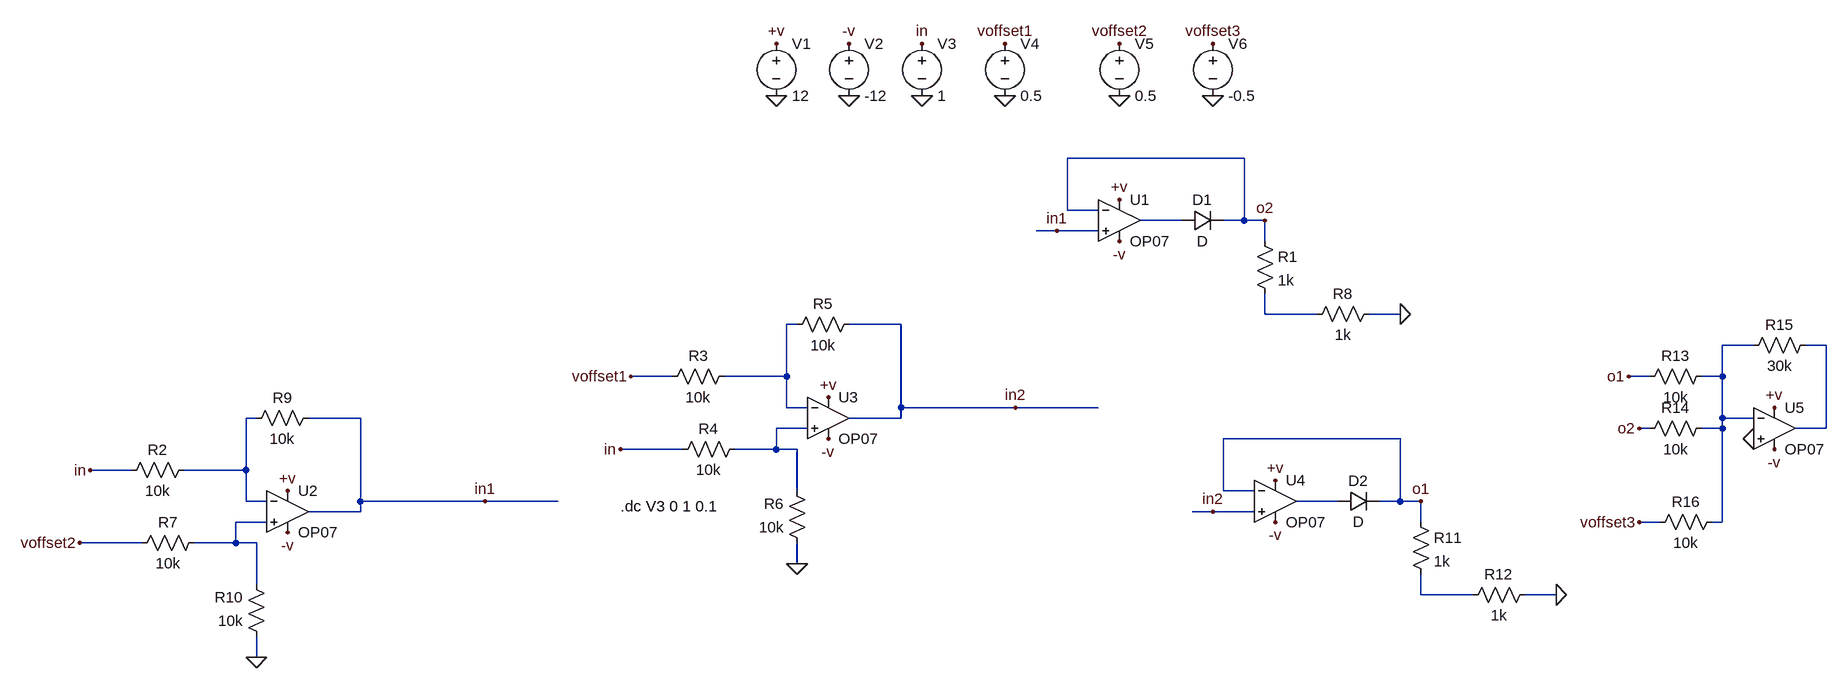
[diagram p0: schematic tent-map.asc]
tent-map.asc, the LTspice schematic file:
Version 4
SHEET 1 1508 996
WIRE 608 208 336 208
WIRE 336 288 336 208
WIRE 384 288 336 288
WIRE 512 304 448 304
WIRE 608 304 608 208
WIRE 608 304 576 304
WIRE 640 304 608 304
WIRE 320 320 288 320
WIRE 384 320 320 320
WIRE 640 336 640 304
WIRE 640 448 640 416
WIRE 720 448 640 448
WIRE 848 448 800 448
WIRE -80 464 -96 464
WIRE 80 464 0 464
WIRE 1392 496 1344 496
WIRE 1504 496 1472 496
WIRE -272 544 -336 544
WIRE -96 544 -96 464
WIRE -96 544 -192 544
WIRE 1232 544 1200 544
WIRE 1344 544 1344 496
WIRE 1344 544 1312 544
WIRE -96 592 -96 544
WIRE -64 592 -96 592
WIRE 80 592 80 464
WIRE 256 592 80 592
WIRE 384 592 256 592
WIRE -912 608 -928 608
WIRE -752 608 -832 608
WIRE 80 608 80 592
WIRE 80 608 0 608
WIRE 1344 608 1344 544
WIRE 1392 608 1344 608
WIRE -64 624 -112 624
WIRE 1232 624 1216 624
WIRE 1344 624 1344 608
WIRE 1344 624 1312 624
WIRE 1504 624 1504 496
WIRE 1504 624 1456 624
WIRE 848 640 576 640
WIRE -256 656 -352 656
WIRE -112 656 -112 624
WIRE -112 656 -176 656
WIRE -80 656 -112 656
WIRE -1104 688 -1168 688
WIRE -928 688 -928 608
WIRE -928 688 -1024 688
WIRE -80 720 -80 656
WIRE 576 720 576 640
WIRE 624 720 576 720
WIRE -928 736 -928 688
WIRE -896 736 -928 736
WIRE -752 736 -752 608
WIRE -560 736 -752 736
WIRE -448 736 -560 736
WIRE 752 736 688 736
WIRE 848 736 848 640
WIRE 848 736 816 736
WIRE 880 736 848 736
WIRE -752 752 -752 736
WIRE -752 752 -832 752
WIRE 560 752 528 752
WIRE 624 752 560 752
WIRE -896 768 -944 768
WIRE 880 768 880 736
WIRE 1248 768 1216 768
WIRE 1344 768 1344 624
WIRE 1344 768 1328 768
WIRE -1088 800 -1184 800
WIRE -944 800 -944 768
WIRE -944 800 -1008 800
WIRE -912 800 -944 800
WIRE -80 832 -80 800
WIRE -912 864 -912 800
WIRE 880 880 880 848
WIRE 960 880 880 880
WIRE 1088 880 1040 880
WIRE -912 976 -912 944
FLAG -112 112 0
FLAG 0 112 0
FLAG 112 112 0
FLAG -112 32 +v
FLAG 0 32 -v
FLAG 112 32 in
FLAG 416 272 +v
FLAG 416 336 -v
FLAG -32 576 +v
FLAG -32 640 -v
FLAG 240 112 0
FLAG 240 32 voffset1
FLAG -80 832 0
FLAG 848 448 0
FLAG -352 656 in
FLAG -336 544 voffset1
FLAG -864 720 +v
FLAG -864 784 -v
FLAG -912 976 0
FLAG 416 112 0
FLAG 416 32 voffset2
FLAG -1168 688 in
FLAG -1184 800 voffset2
FLAG 656 704 +v
FLAG 656 768 -v
FLAG 1088 880 0
FLAG -560 736 in1
FLAG 320 320 in1
FLAG 256 592 in2
FLAG 560 752 in2
FLAG 880 736 o1
FLAG 1200 544 o1
FLAG 640 304 o2
FLAG 1216 624 o2
FLAG 1392 640 0
FLAG 1424 592 +v
FLAG 1424 656 -v
FLAG 1216 768 voffset3
FLAG 560 112 0
FLAG 560 32 voffset3
SYMBOL voltage -112 16 R0
WINDOW 123 0 0 Left 0
WINDOW 39 0 0 Left 0
SYMATTR InstName V1
SYMATTR Value 12
SYMBOL voltage 0 16 R0
WINDOW 123 0 0 Left 0
WINDOW 39 0 0 Left 0
SYMATTR InstName V2
SYMATTR Value -12
SYMBOL voltage 112 16 R0
WINDOW 123 0 0 Left 0
WINDOW 39 0 0 Left 0
SYMATTR InstName V3
SYMATTR Value 1
SYMBOL OpAmps\\OP07 416 240 R0
SYMATTR InstName U1
SYMBOL diode 512 320 R270
WINDOW 0 32 32 VTop 2
WINDOW 3 0 32 VBottom 2
SYMATTR InstName D1
SYMBOL res 624 320 R0
SYMATTR InstName R1
SYMATTR Value 1k
SYMBOL OpAmps\\OP07 -32 544 R0
SYMATTR InstName U3
SYMBOL voltage 240 16 R0
WINDOW 123 0 0 Left 0
WINDOW 39 0 0 Left 0
SYMATTR InstName V4
SYMATTR Value 0.5
SYMBOL res -176 528 R90
WINDOW 0 0 56 VBottom 2
WINDOW 3 32 56 VTop 2
SYMATTR InstName R3
SYMATTR Value 10k
SYMBOL res -160 640 R90
WINDOW 0 0 56 VBottom 2
WINDOW 3 32 56 VTop 2
SYMATTR InstName R4
SYMATTR Value 10k
SYMBOL res 16 448 R90
WINDOW 0 0 56 VBottom 2
WINDOW 3 32 56 VTop 2
SYMATTR InstName R5
SYMATTR Value 10k
SYMBOL res -64 816 R180
WINDOW 0 36 76 Left 2
WINDOW 3 36 40 Left 2
SYMATTR InstName R6
SYMATTR Value 10k
SYMBOL res 816 432 R90
WINDOW 0 0 56 VBottom 2
WINDOW 3 32 56 VTop 2
SYMATTR InstName R8
SYMATTR Value 1k
SYMBOL OpAmps\\OP07 -864 688 R0
SYMATTR InstName U2
SYMBOL res -1008 672 R90
WINDOW 0 0 56 VBottom 2
WINDOW 3 32 56 VTop 2
SYMATTR InstName R2
SYMATTR Value 10k
SYMBOL res -992 784 R90
WINDOW 0 0 56 VBottom 2
WINDOW 3 32 56 VTop 2
SYMATTR InstName R7
SYMATTR Value 10k
SYMBOL res -816 592 R90
WINDOW 0 0 56 VBottom 2
WINDOW 3 32 56 VTop 2
SYMATTR InstName R9
SYMATTR Value 10k
SYMBOL res -896 960 R180
WINDOW 0 36 76 Left 2
WINDOW 3 36 40 Left 2
SYMATTR InstName R10
SYMATTR Value 10k
SYMBOL voltage 416 16 R0
WINDOW 123 0 0 Left 0
WINDOW 39 0 0 Left 0
SYMATTR InstName V5
SYMATTR Value 0.5
SYMBOL OpAmps\\OP07 656 672 R0
SYMATTR InstName U4
SYMBOL diode 752 752 R270
WINDOW 0 32 32 VTop 2
WINDOW 3 0 32 VBottom 2
SYMATTR InstName D2
SYMBOL res 864 752 R0
SYMATTR InstName R11
SYMATTR Value 1k
SYMBOL res 1056 864 R90
WINDOW 0 0 56 VBottom 2
WINDOW 3 32 56 VTop 2
SYMATTR InstName R12
SYMATTR Value 1k
SYMBOL OpAmps\\OP07 1424 560 R0
SYMATTR InstName U5
SYMBOL res 1328 528 R90
WINDOW 0 0 56 VBottom 2
WINDOW 3 32 56 VTop 2
SYMATTR InstName R13
SYMATTR Value 10k
SYMBOL res 1328 608 R90
WINDOW 0 0 56 VBottom 2
WINDOW 3 32 56 VTop 2
SYMATTR InstName R14
SYMATTR Value 10k
SYMBOL res 1488 480 R90
WINDOW 0 0 56 VBottom 2
WINDOW 3 32 56 VTop 2
SYMATTR InstName R15
SYMATTR Value 30k
SYMBOL voltage 560 16 R0
WINDOW 123 0 0 Left 0
WINDOW 39 0 0 Left 0
SYMATTR InstName V6
SYMATTR Value -0.5
SYMBOL res 1344 752 R90
WINDOW 0 0 56 VBottom 2
WINDOW 3 32 56 VTop 2
SYMATTR InstName R16
SYMATTR Value 10k
TEXT -352 744 Left 2 !.dc V3 0 1 0.1

The netlist it stands for:
* tent-map.asc
V1 +v 0 12
V2 -v 0 -12
V3 in 0 1
XU1 in1 o2 +v -v N001 LT1001  ; OP07, pins In+ In- V+ V- OUT
D1 N001 o2 D
R1 o2 N002 1k
XU3 N007 N003 +v -v in2 LT1001  ; OP07, pins In+ In- V+ V- OUT
V4 voffset1 0 0.5
R3 N003 voffset1 10k
R4 N007 in 10k
R5 in2 N003 10k
R6 0 N007 10k
R8 0 N002 1k
XU2 N009 N006 +v -v in1 LT1001  ; OP07, pins In+ In- V+ V- OUT
R2 N006 in 10k
R7 N009 voffset2 10k
R9 in1 N006 10k
R10 0 N009 10k
V5 voffset2 0 0.5
XU4 in2 o1 +v -v N008 LT1001  ; OP07, pins In+ In- V+ V- OUT
D2 N008 o1 D
R11 o1 N010 1k
R12 0 N010 1k
XU5 0 N004 +v -v N005 LT1001  ; OP07, pins In+ In- V+ V- OUT
R13 N004 o1 10k
R14 N004 o2 10k
R15 N005 N004 30k
V6 voffset3 0 -0.5
R16 N004 voffset3 10k
.model D D
.lib standard.dio
.dc V3 0 1 0.1
.lib LTC.lib
.backanno
.end